# EAGLE design ROB V1.1 (EAGLE 9.6.2)
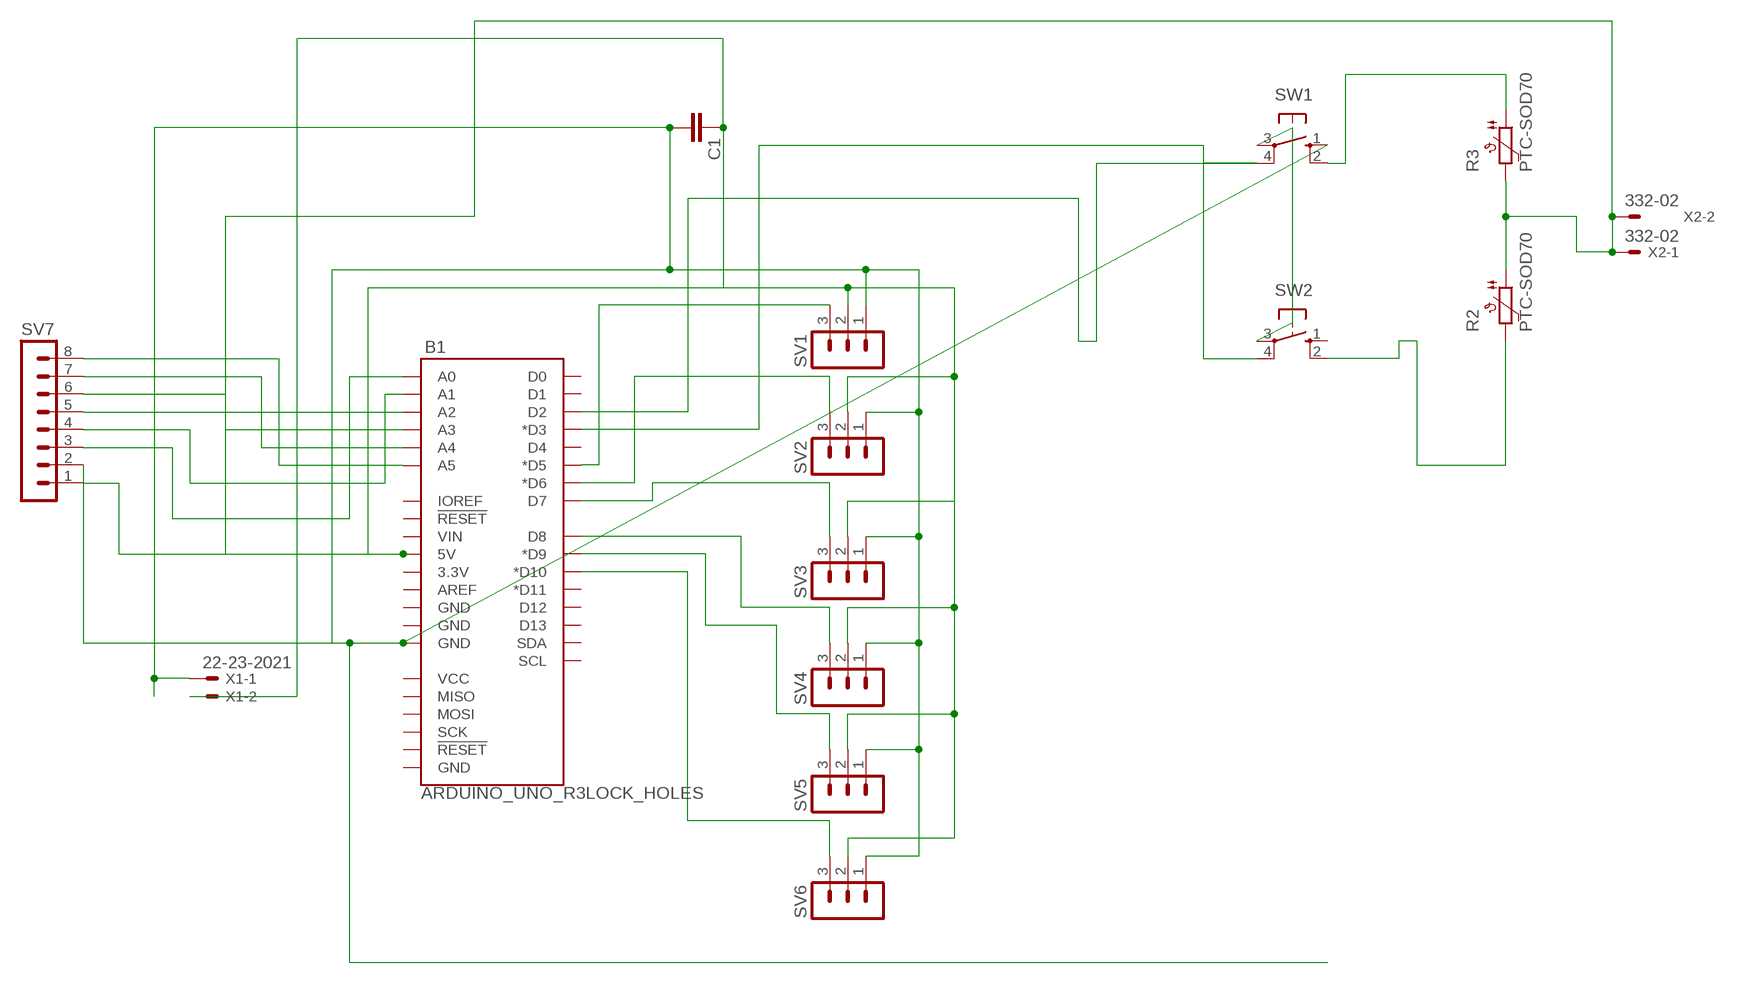
[diagram p0: schematic, sheet 1]

## Parts
B1  ARDUINO_UNO_R3LOCK_HOLES  [ARDUINO_R3_LOCK_HOLES]
C1  C2.5/2  [C2.5-2]
R2  PTC-SOD70  [SOD70]
R3  PTC-SOD70  [SOD70]
SV1  MA03-1  [MA03-1]
SV2  MA03-1  [MA03-1]
SV3  MA03-1  [MA03-1]
SV4  MA03-1  [MA03-1]
SV5  MA03-1  [MA03-1]
SV6  MA03-1  [MA03-1]
SV7  MA08-1  [MA08-1]
SW1  10-XX  [B3F-10XX]
SW2  10-XX  [B3F-10XX]
X1  22-23-2021  [22-23-2021]
X2  332-02  [332-02]

## Nets
5V: B1.5V C1.1 R2.1 R3.2 SV1.2 SV2.2 SV3.2 SV4.2 SV5.2 SV6.2 SV7.1 X1.2 X2.1 X2.2
D2: B1.D2 SW1.4(P1)
D3: B1.D3(*D3) SW2.4(P1)
D5: B1.D5(*D5) SV1.3
D6: B1.D6(*D6) SV2.3
D7: B1.D7 SV3.3
D8: B1.D8 SV4.3
D9: B1.D9(*D9) SV5.3
D10: B1.D10(*D10) SV6.3
GND: B1.GND@2(GND) C1.2 SV1.1 SV2.1 SV3.1 SV4.1 SV5.1 SV6.1 SV7.2 SW1.1(S) X1.1
N$11: B1.A5 SV7.8
N$12: B1.A4 SV7.7
N$13: B1.A3 SV7.6
N$14: B1.A2 SV7.5
N$15: B1.A1 SV7.4
N$18: R3.1 SW1.2(S1)
N$19: B1.A0 SV7.3
S-R: R2.2 SW2.2(S1)
S-S: SW1.3(P) SW2.3(P)
Unconnected: B1.3.3V B1.AREF B1.D0 B1.D1 B1.D4 B1.D11(*D11) B1.D12 B1.D13 B1.GND@1(GND) B1.GND@3(GND) B1.GND@4(GND) B1.IOREF B1.MISO B1.MOSI B1.RESET@1(!RESET!) B1.RESET@2(!RESET!) B1.SCK B1.SCL B1.SDA B1.VCC B1.VIN SW2.1(S)

## Library data of the parts
B1 = Arduino Uno:ARDUINO_UNO_R3: Arduino R3 Footprint with SPI header Arduino Uno R3 Compatible Footprint. Matches PCB size of the original board. SparkFun Products: SAMD21 Dev Breakout <https://www.sparkfun.com/products/13672> RedBoard <https://www.sparkfun.com/products/12757> R3 Stackable Headers <https://www.sparkfun.com/products/11417>
C1 = capacitor-wima:C: CAPACITOR naming: grid - package width
R2 R3 = ptc-ntc:PTC-: Positive Temperature Coefficient Resistor (PTC) termistor Philips KTY81-210 - KTY81-252 Source: 153627-da-01-en-Temperatur-Sensor_KTY10-6_Philips.pdf; OC_FARNELL: unknown; OC_NEWARK: unknown
SV1-SV6 = con-lstb:MA03-1: PIN HEADER; OC_FARNELL: unknown; OC_NEWARK: unknown
SV7 = con-lstb:MA08-1: PIN HEADER; OC_FARNELL: unknown; OC_NEWARK: unknown
SW1 SW2 = buttons:10-XX: OMRON SWITCH
X1 = con-molex:22-23-2021: .100" (2.54mm) Center Header - 2 Pin; MF: MOLEX; MPN: 22-23-2021; OC_FARNELL: 1462926; OC_NEWARK: 25C3832
X2 = con-garry:332-02: 2 Pin - 2mm Dual Row Source: www.mpe-connector.de / garry_shortform_2012.pdf

## Board
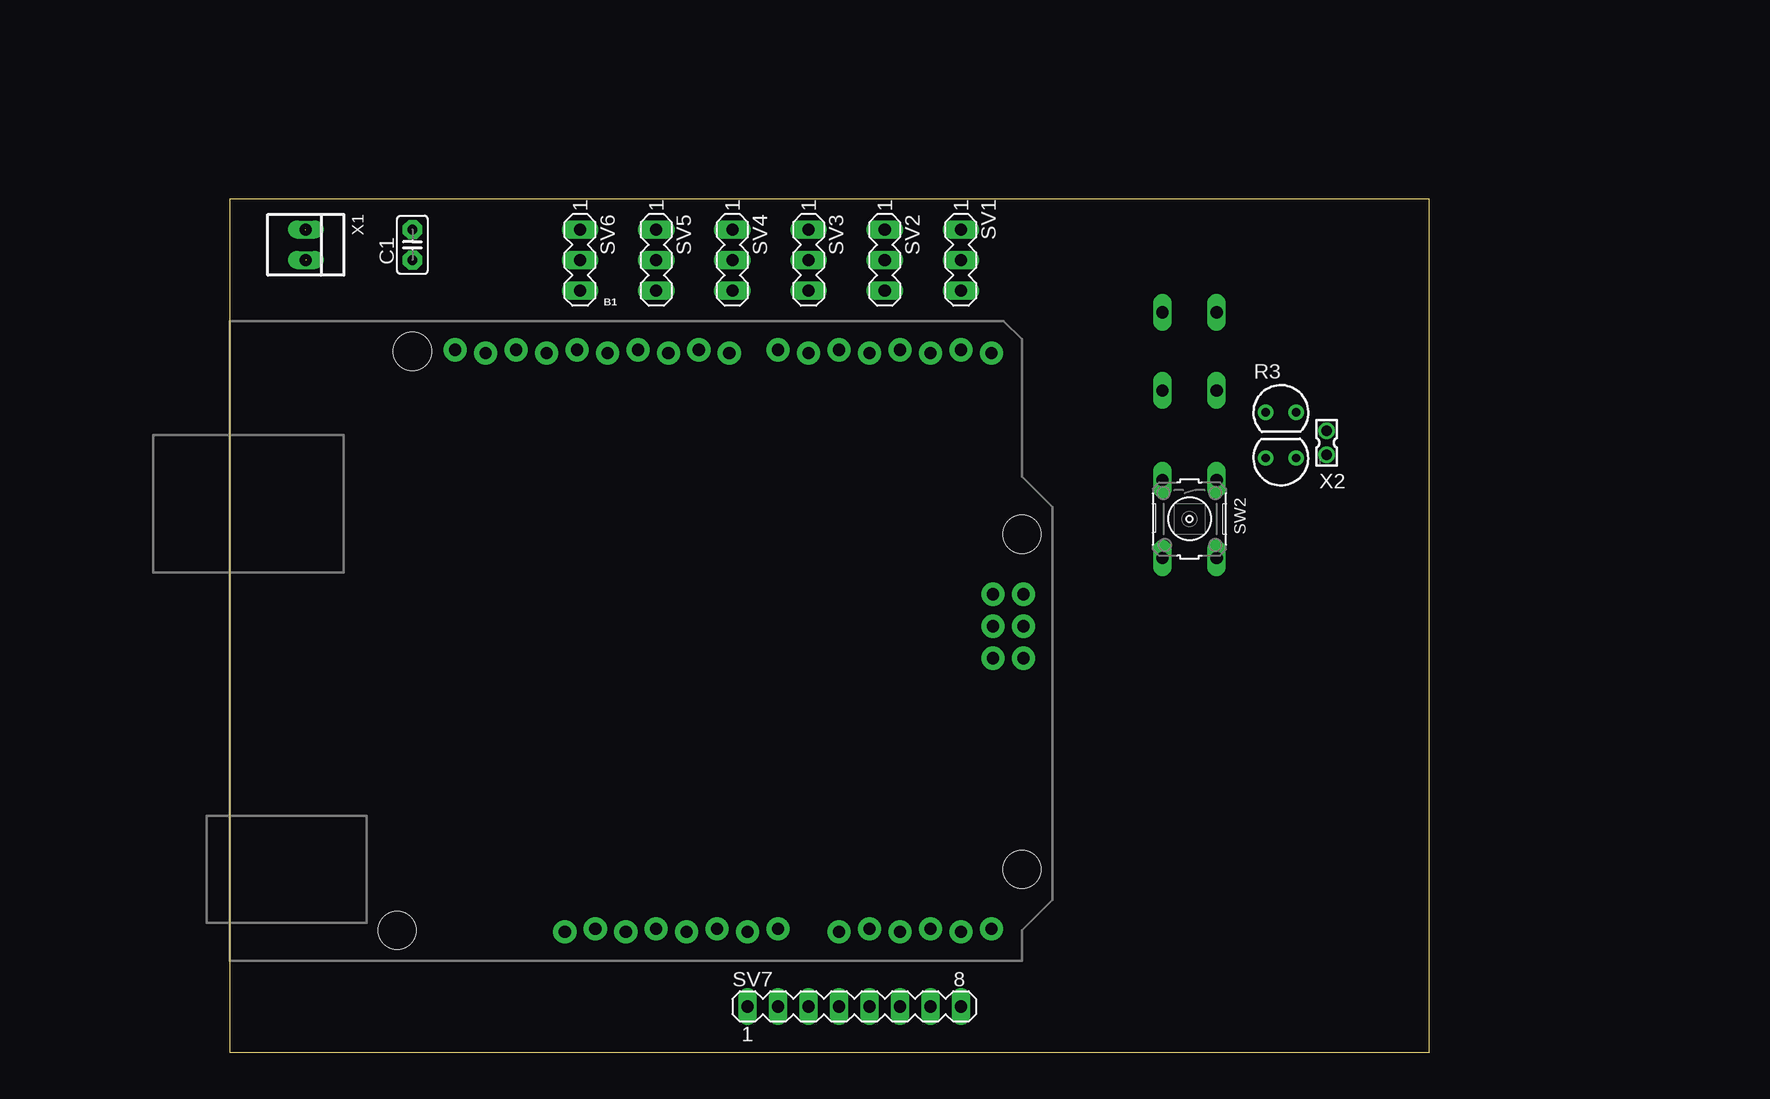
[diagram p1: board, top side]
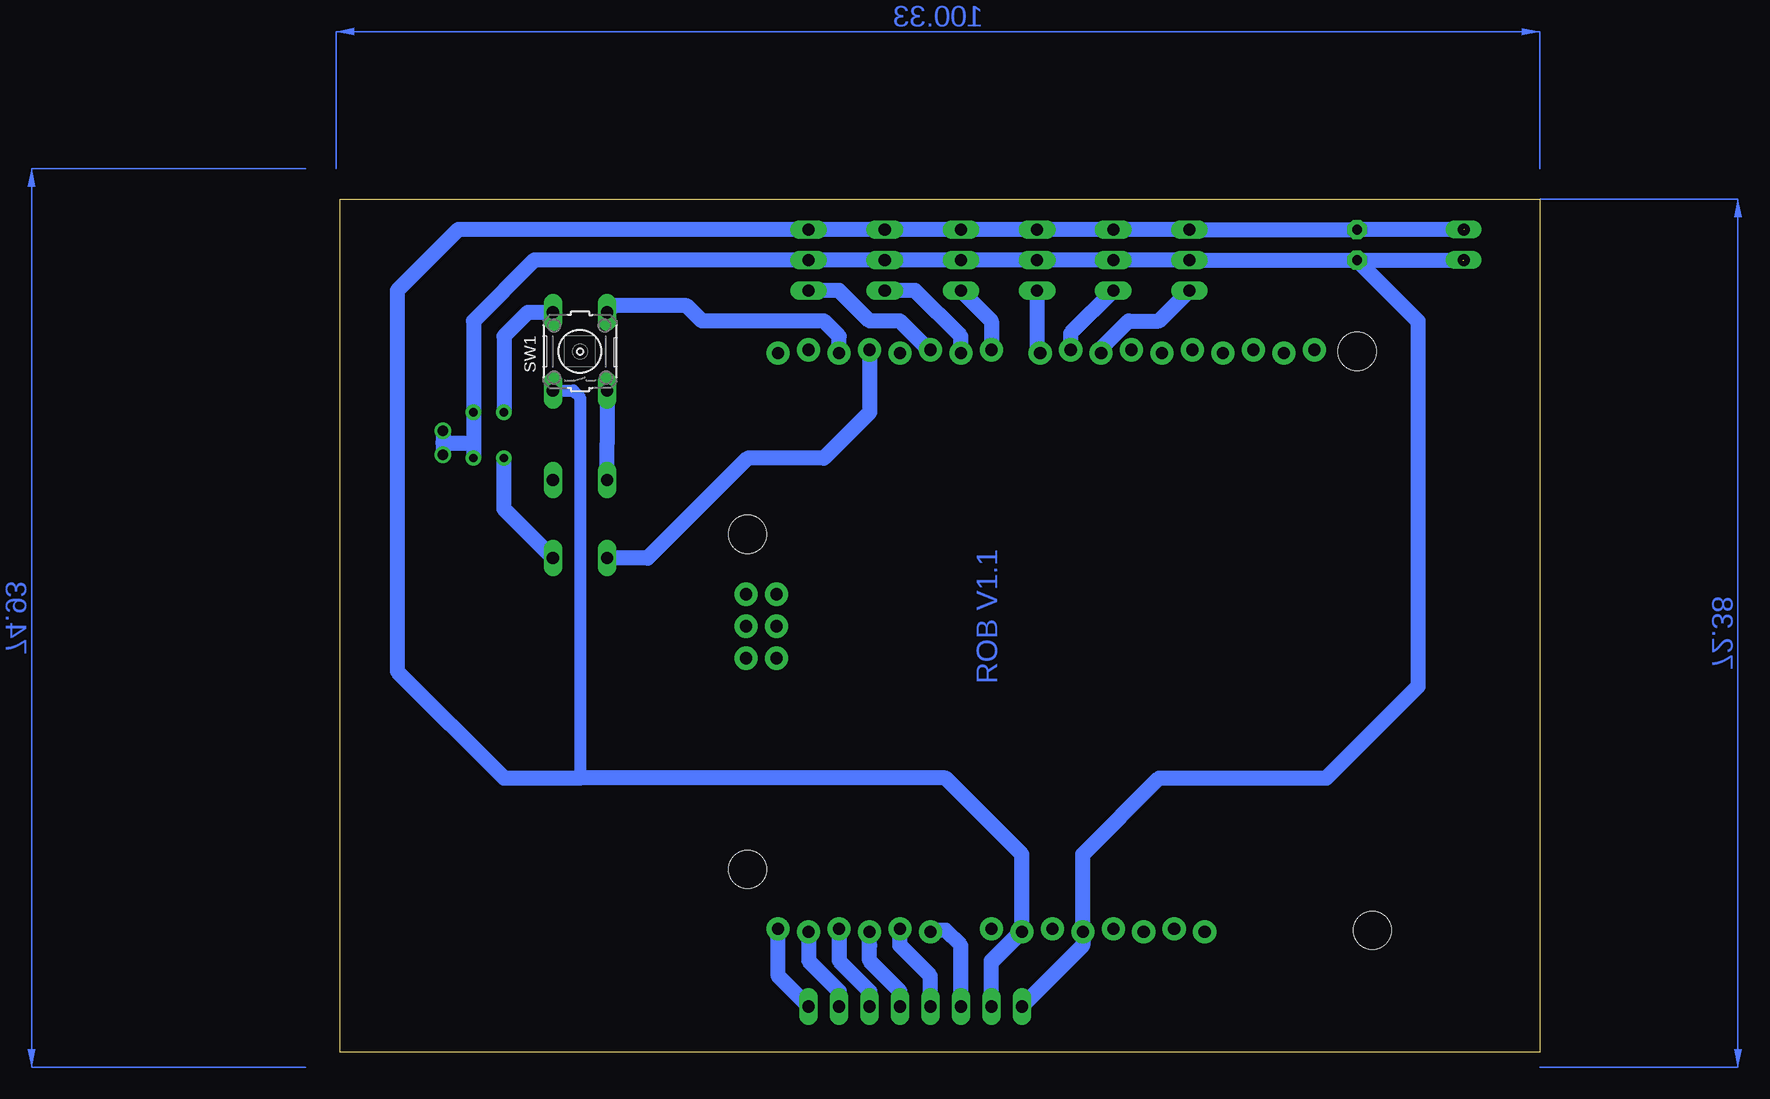
[diagram p2: board, bottom side, seen from below]

Size 100 x 71.11 mm. Coordinates in mm from the lower left corner, seen from the top.
Outline: 0,0 100,0 100,71.11 0,71.11 0,0
Copper layers (1*16): Top 0.035mm / dielectric 1.5mm / Bottom 0.035mm
Design rules "default": minimum track width 6mil, minimum drill 0.35mm, track to track 6mil, track to pad 6mil, pad to pad 6mil, via to via 6mil, smd to smd 6mil, copper to edge 40mil, drill to drill 6mil, minimum pad ring 10mil, minimum via ring 8mil, stop-mask expansion 4mil, vias tented up to drill 0mil, thermal gap 10mil

### Footprints (pad centres in the part's own frame; a part is rotated, then mirrored left to right if it is on the bottom)
ARDUINO_R3_LOCK_HOLES = drill 1.016 pad 1.93: 3.3V 35.56,2.667; 5V 38.1,2.413; A0 50.8,2.413; A1 53.34,2.667; A2 55.88,2.413; A3 58.42,2.667; A4 60.96,2.413; A5 63.5,2.667; AREF 23.876,50.927; D0 63.5,50.673; D1 60.96,50.927; D2 58.42,50.673; D3 55.88,50.927; D4 53.34,50.673; D5 50.8,50.927; D6 48.26,50.673; D7 45.72,50.927; D8 41.656,50.673; D9 39.116,50.927; D10 36.576,50.673; D11 34.036,50.927; D12 31.496,50.673; D13 28.956,50.927; GND@1 40.64,2.667; GND@2 43.18,2.413; GND@3 26.416,50.673; GND@4 66.18,25.223; IOREF 30.48,2.667; MISO 63.64,30.557; MOSI 66.18,27.89; NC 27.94,2.413; RESET@1 33.02,2.413; RESET@2 63.64,25.223; SCK 63.64,27.89; SCL 18.796,50.927; SDA 21.336,50.673; VCC 66.18,30.557; VIN 45.72,2.667 | hole 3.175: 15.24,50.8; 66.04,35.56; 66.04,7.62; 13.97,2.54
C2.5-2 = drill 0.813 pad 1.6 octagon: 1 -1.27,0; 2 1.27,0
SOD70 = drill 0.7 pad 1.27: 1 -1.27,0; 2 1.27,0
MA03-1 = drill 1.016 long: 1 -2.54,0; 2 0,0; 3 2.54,0
MA08-1 = drill 1.016 long: 1 -8.89,0; 2 -6.35,0; 3 -3.81,0; 4 -1.27,0; 5 1.27,0; 6 3.81,0; 7 6.35,0; 8 8.89,0
B3F-10XX = drill 1.016 long: 1 -3.251,2.261; 2 3.251,2.261; 3 -3.251,-2.261; 4 3.251,-2.261
22-23-2021 = drill 1 long: 1 -1.27,0; 2 1.27,0
332-02 = drill 0.9 pad 1.27: 1 0,-1; 2 0,1

### Placement (x,y rotation side)
B1  0,7.62 0 top
C1  15.24,67.31 90 top
R2  87.63,49.53 180 top
R3  87.63,53.34 0 top
SV1  60.96,66.04 270 top
SV2  54.61,66.04 270 top
SV3  48.26,66.04 270 top
SV4  41.91,66.04 270 top
SV5  35.56,66.04 270 top
SV6  29.21,66.04 270 top
SV7  52.07,3.81 0 top
SW1  80.01,58.42 90 bottom
SW2  80.01,44.45 270 top
X1  6.35,67.31 270 top
X2  91.44,50.8 0 top

### Tracks (layer width: path | path; a pad name or v marks a point on that pad's centre or on a via)
5V  (1 unrouted)
  Bottom 1.27: SV1.2 62.08,66.04 | SV1.2 SV2.2 SV3.2 SV4.2 SV5.2 SV6.2 C1.1 | 88.9,50.8 R3.2 88.9,60.96 83.82,66.04 SV1.2 | 88.9,50.8 R2.1 | C1.1 6.44,66.04 | 88.9,50.8 91.44,50.8 X2.2 X2.1 | SV7.1 38.1,8.89 B1.5V 38.1,16.51 31.75,22.86 17.78,22.86 10.16,30.48 10.16,60.96 C1.1
D2
  Bottom 0.813: 58.42,58.42 B1.D2
  Bottom 1.27: B1.D2 58.42,59.69 59.69,60.96 69.85,60.96 71.12,62.23 77.19,62.23 SW1.4
D3
  Bottom 1.27: B1.D3 55.88,53.34 59.69,49.53 66.04,49.53 74.37,41.2 SW2.4
D5
  Bottom 1.27: B1.D5 50.93,58.55 53.34,60.96 55.88,60.96 58.42,63.5 SV1.3
D6
  Bottom 1.27: B1.D6 48.26,59.69 52.07,63.5 SV2.3
D7
  Bottom 1.27: SV3.3 45.72,60.96 B1.D7
D8
  Bottom 1.27: B1.D8 41.91,58.55 SV4.3
D9
  Bottom 1.27: B1.D9 39.12,59.94 SV5.3
D10
  Bottom 1.27: B1.D10 36.58,58.67 34.29,60.96 31.75,60.96 SV6.3
GND  (1 unrouted)
  Bottom 1.016: SW1.1 80.57,55.17 80.01,54.61 80.01,22.86
  Bottom 1.27: 45.72,7.62 43.31,10.03 B1.GND@2 | B1.GND@2 45.72,7.49 SV7.2 | 6.28,68.58 C1.2 SV6.1 SV5.1 SV4.1 SV3.1 SV2.1 SV1.1 90.17,68.58 95.25,63.5 95.25,31.75 86.36,22.86 80.01,22.86 49.53,22.86 43.18,16.51 B1.GND@2
N$11
  Bottom 1.27: SV7.8 63.5,6.35 B1.A5
N$12
  Bottom 1.27: B1.A4 60.96,7.62 58.42,5.08 SV7.7
N$13
  Bottom 1.27: B1.A3 58.42,7.62 55.88,5.08 SV7.6
N$14
  Bottom 1.27: 55.88,8.89 B1.A2 55.88,7.62 53.34,5.08 SV7.5
N$15
  Bottom 1.27: SV7.4 50.8,6.35 53.34,8.89 B1.A1
N$18
  Bottom 1.27: SW1.2 84.38,61.67 86.36,59.69 R3.1
N$19
  Bottom 1.27: B1.A0 50.67,10.16 49.53,10.16 48.26,8.89 SV7.3
S-R
  Bottom 1.27: SW2.2 86.36,45.29 R2.2
S-S
  Bottom 1.27: SW1.3 77.75,52.07 77.75,50.8 SW2.3
(copper drawn outside any net)
  shapes: Bottom area x3

### Text on the board
Bottom: ROB V1.1